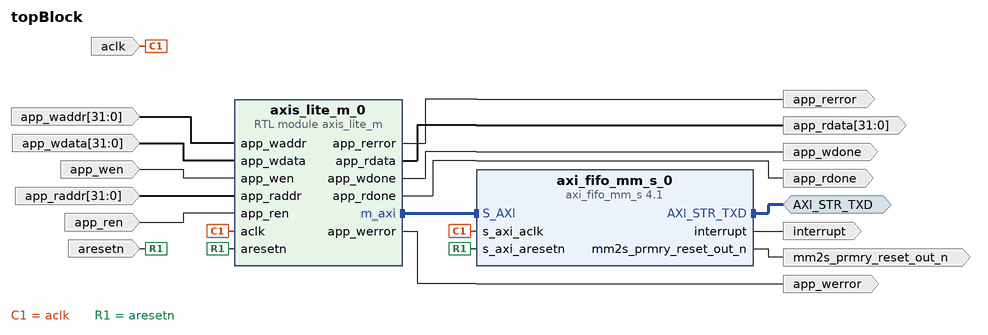
[diagram p0: block diagram of the top level]
# Vivado block design topBlock, xc7k70tfbv676-1, Vivado 2018.1
create_bd_design topBlock

create_bd_intf_port -mode Master -vlnv xilinx.com:interface:axis_rtl:1.0 AXI_STR_TXD
set_property -dict {CONFIG.FREQ_HZ 300000000} [get_bd_intf_ports AXI_STR_TXD]
create_bd_port -dir I -type clk aclk
set_property -dict {CONFIG.FREQ_HZ 300000000} [get_bd_ports aclk]
create_bd_port -dir I -type rst aresetn
create_bd_port -dir I -from 31 -to 0 app_waddr
create_bd_port -dir I -from 31 -to 0 app_wdata
create_bd_port -dir I app_wen
create_bd_port -dir I -from 31 -to 0 app_raddr
create_bd_port -dir I app_ren
create_bd_port -dir O app_wdone
create_bd_port -dir O app_rerror
create_bd_port -dir O app_werror
create_bd_port -dir O app_rdone
create_bd_port -dir O -type intr interrupt
create_bd_port -dir O -type rst mm2s_prmry_reset_out_n
create_bd_port -dir O -from 31 -to 0 app_rdata

create_bd_cell -type ip -vlnv xilinx.com:ip:axi_fifo_mm_s:4.1 axi_fifo_mm_s_0
set_property -dict {CONFIG.C_USE_RX_DATA 0 CONFIG.C_USE_TX_CTRL 0} [get_bd_cells axi_fifo_mm_s_0]
create_bd_cell -type module -reference axis_lite_m axis_lite_m_0

# ---- connections ----

connect_bd_intf_net [get_bd_intf_pins axis_lite_m_0/m_axi] [get_bd_intf_pins axi_fifo_mm_s_0/S_AXI]
connect_bd_intf_net [get_bd_intf_ports AXI_STR_TXD] [get_bd_intf_pins axi_fifo_mm_s_0/AXI_STR_TXD]
connect_bd_net -net clk_wiz_clk_out1 [get_bd_ports aclk] [get_bd_pins axi_fifo_mm_s_0/s_axi_aclk] [get_bd_pins axis_lite_m_0/aclk]
connect_bd_net -net rst_clk_wiz_100M_peripheral_aresetn [get_bd_ports aresetn] \
  [get_bd_pins axi_fifo_mm_s_0/s_axi_aresetn] [get_bd_pins axis_lite_m_0/aresetn]
connect_bd_net [get_bd_ports app_waddr] [get_bd_pins axis_lite_m_0/app_waddr]
connect_bd_net -net app_data_1 [get_bd_ports app_wdata] [get_bd_pins axis_lite_m_0/app_wdata]
connect_bd_net [get_bd_ports app_wen] [get_bd_pins axis_lite_m_0/app_wen]
connect_bd_net [get_bd_ports app_raddr] [get_bd_pins axis_lite_m_0/app_raddr]
connect_bd_net [get_bd_ports app_ren] [get_bd_pins axis_lite_m_0/app_ren]
connect_bd_net [get_bd_pins axis_lite_m_0/app_wdone] [get_bd_ports app_wdone]
connect_bd_net [get_bd_pins axis_lite_m_0/app_rerror] [get_bd_ports app_rerror]
connect_bd_net [get_bd_pins axis_lite_m_0/app_werror] [get_bd_ports app_werror]
connect_bd_net [get_bd_pins axis_lite_m_0/app_rdone] [get_bd_ports app_rdone]
connect_bd_net [get_bd_pins axi_fifo_mm_s_0/interrupt] [get_bd_ports interrupt]
connect_bd_net [get_bd_pins axi_fifo_mm_s_0/mm2s_prmry_reset_out_n] [get_bd_ports mm2s_prmry_reset_out_n]
connect_bd_net [get_bd_pins axis_lite_m_0/app_rdata] [get_bd_ports app_rdata]

# ---- address map ----
assign_bd_address -offset 0x44A00000 -range 4K -target_address_space [get_bd_addr_spaces axis_lite_m_0/m_axi] [get_bd_addr_segs axi_fifo_mm_s_0/S_AXI/Mem0]

validate_bd_design
save_bd_design
